# Altium project PCB_Project_3.PrjPcb
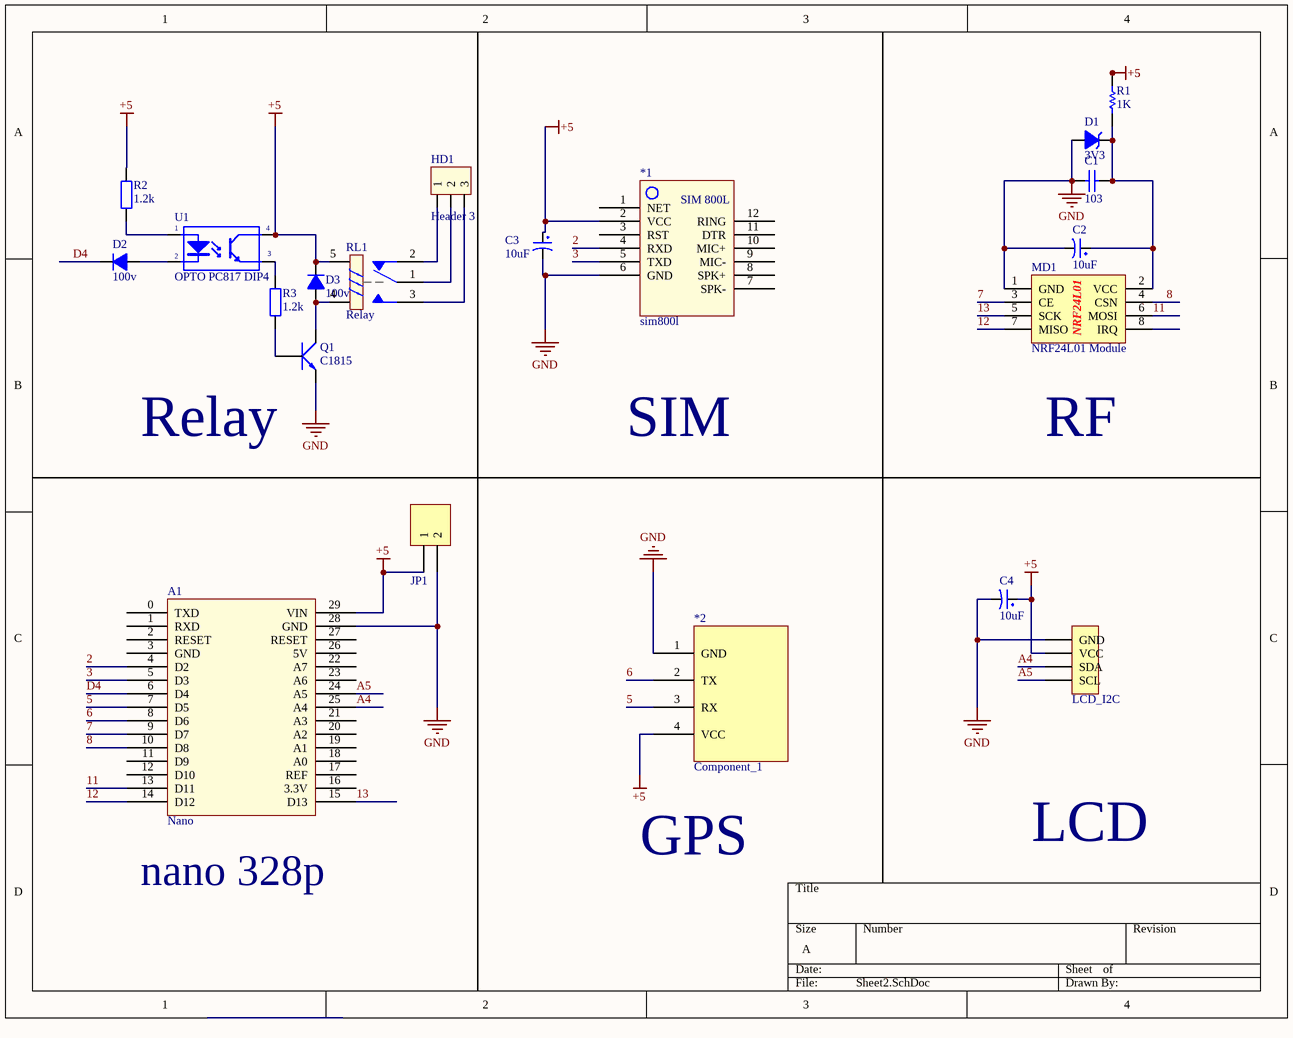
[diagram p0: Sheet2.SchDoc]
1 sheet, 20 parts. Net scope: global (net labels, ports and power ports of the same name join across sheets).
Board file: PCB2.PcbDoc

## Sheet Sheet2.SchDoc
size A

### Parts
*1  sim800l  [SIM 800L]
*2  Component_1  [NEO6M - duplicate1]
A1  Nano  [Arduino nano]
C1  103  [tu gom]
C2  10uF  [tu hoa 4mm]
C3  10uF  [tu hoa 4mm]
C4  10uF  [tu hoa 4mm]
D1  3V3  [DZ0.5A]
D2  100v  [DIODE 1A]
D3  100v  [DIODE 1A]
H1  LCD_I2C  [XH2.54M-4]
HD1  Header 3  [HED3]
JP1  Header 2_1  [HED2]  (value not drawn)
MD1  NRF24L01 Module  [NRF24L01]
Q1  C1815  [TO92]
R1  value 1K  [R1/4W]  (hidden comment: Res1)
R2  1.2k  [tro vach 1/4w]
R3  1.2k  [tro vach 1/4w]
RL1  Relay  [Relay 5 Chan SRD]
U1  OPTO PC817 DIP4  [DIP4]

### Nets
+5: *1.2(VCC) *2.4(VCC) A1.29(VIN) C3.1 C4.1 D3.2(K) H1.2(VCC) JP1.1 R1.2 R2.1 RL1.5 U1.4(C)
GND: *1.6(GND) *2.1(GND) A1.28(GND) C1.2 C2.2 C3.2 C4.2 D1.1(A) H1.1(GND) JP1.2 MD1.1(GND) Q1.1(E)
2: *1.4(RXD) A1.4(D2)
3: *1.5(TXD) A1.5(D3)
5: *2.3(RX) A1.7(D5)
6: *2.2(TX) A1.8(D6)
7: A1.9(D7) MD1.3(CE)
8: A1.10(D8) MD1.4(CSN)
11: A1.13(D11) MD1.6(MOSI)
12: A1.14(D12) MD1.7(MISO)
13: A1.15(D13) MD1.5(SCK)
A4: A1.25(A4) H1.3(SDA)
A5: A1.24(A5) H1.4(SCL)
D4: A1.6(D4) D2.2(K)
NetC1_1: C1.1 C2.1 D1.2(K) MD1.2(VCC) R1.1
NetD2_1: D2.1(A) U1.2(K)
NetD3_1: D3.1(A) Q1.2(C) RL1.4
NetHD1_1: HD1.1 RL1.2
NetHD1_2: HD1.2 RL1.1
NetHD1_3: HD1.3 RL1.3
NetQ1_3: Q1.3(B) R3.2
NetR2_2: R2.2 U1.1(A)
NetR3_1: R3.1 U1.3(E)

Not connected (* = marked no-connect by the designer): *1 1(NET) 3(RST) 7(SPK-) 8(SPK+) 9(MIC-) 10(MIC+) 11(DTR) 12(RING); A1 0(TXD) 1(RXD) 2(RESET) 3(GND) 11(D9) 12(D10) 16(3.3V) 17(REF) 18(A0) 19(A1) 20(A2) 21(A3) 22(A7) 23(A6) 26(5V) 27(RESET); MD1 8(IRQ)

### Notes on the sheet
- (near Q1) Relay
- SIM
- RF
- (near A1) nano 328p
- GPS
- LCD
- (in symbol NRF24L01 Module) NRF24L01
- (in symbol sim800l) SIM 800L

### Library data of the parts
A1 = Arduino Nano
C1 = Tu gom 103 50V: Cắm; So_Chan: 2; Ten_Linh_Kien: Tụ gốm 103 10nF 50V; Don_Vi: Con; Ma_Hang: MH000936; Chung_Loai: Cắm; Kieu_Chan: *
C2-C4 = Tu Hoa 10uF 16V 4x7: Cắm; So_Chan: 2; Don_Vi: Con; Ten_Linh_Kien: Tụ Hóa 10uF 16V; Ma_Hang: MH006855; Chung_Loai: Cắm; Kieu_Chan: *
D1 = DZ: Diode Zenner; Value: 3v3
D2 D3 = Diode 1N4007: Cắm; Ten_Linh_Kien: Diode 1N4007 1A (DIP); Don_Vi: Con; Ma_Hang: MH001063; Ghi Chu: *; Kieu_Chan: *; Chung_Loai: Cắm
H1 = Header 4P 2.54 Duc Thang: Cắm; Ten_Linh_Kien: Header 4P XH2.54-4P Đực Thẳng; Don_Vi: Con; Ma_Hang: MH001285; Chung_Loai: Cắm
HD1 = Hed3: Header 3 (Green); Value: Header 3
JP1 = Header 2_1: Header, 2-Pin; Manufacturer: Generic Components; Class: Connector; Value: Header 2
Q1 = C1815: NPN transistor; Value: C9014
R1 = Res1_4: Resistor; Manufacturer: Generic Components; Class: Passive; Published: 08/06/2000; Publisher: Altium Hobart Technology Centre; SubClass: Resistor
R2 R3 = Tro Vach 1/4W 5% 1.2k: Cắm; Don_Vi: Con; Ten_Linh_Kien: Trở Vạch 1/4w 5% 1.2k; So_Chan: 2; Ma_Hang: MH007348; Chung_Loai: Cắm; Kieu_Chan: *
RL1 = Relay 5 Chan SRD: Relay 5 Chan; Ma_Hang: MH009374; Ten: Relay 5V10A SRD-05VDC-SL-C Chính Hãng
U1 = OPTO PC817 DIP4: Single Opto; Value: PC817